# EAGLE design 328p_ ver1 (EAGLE 7.1.0)
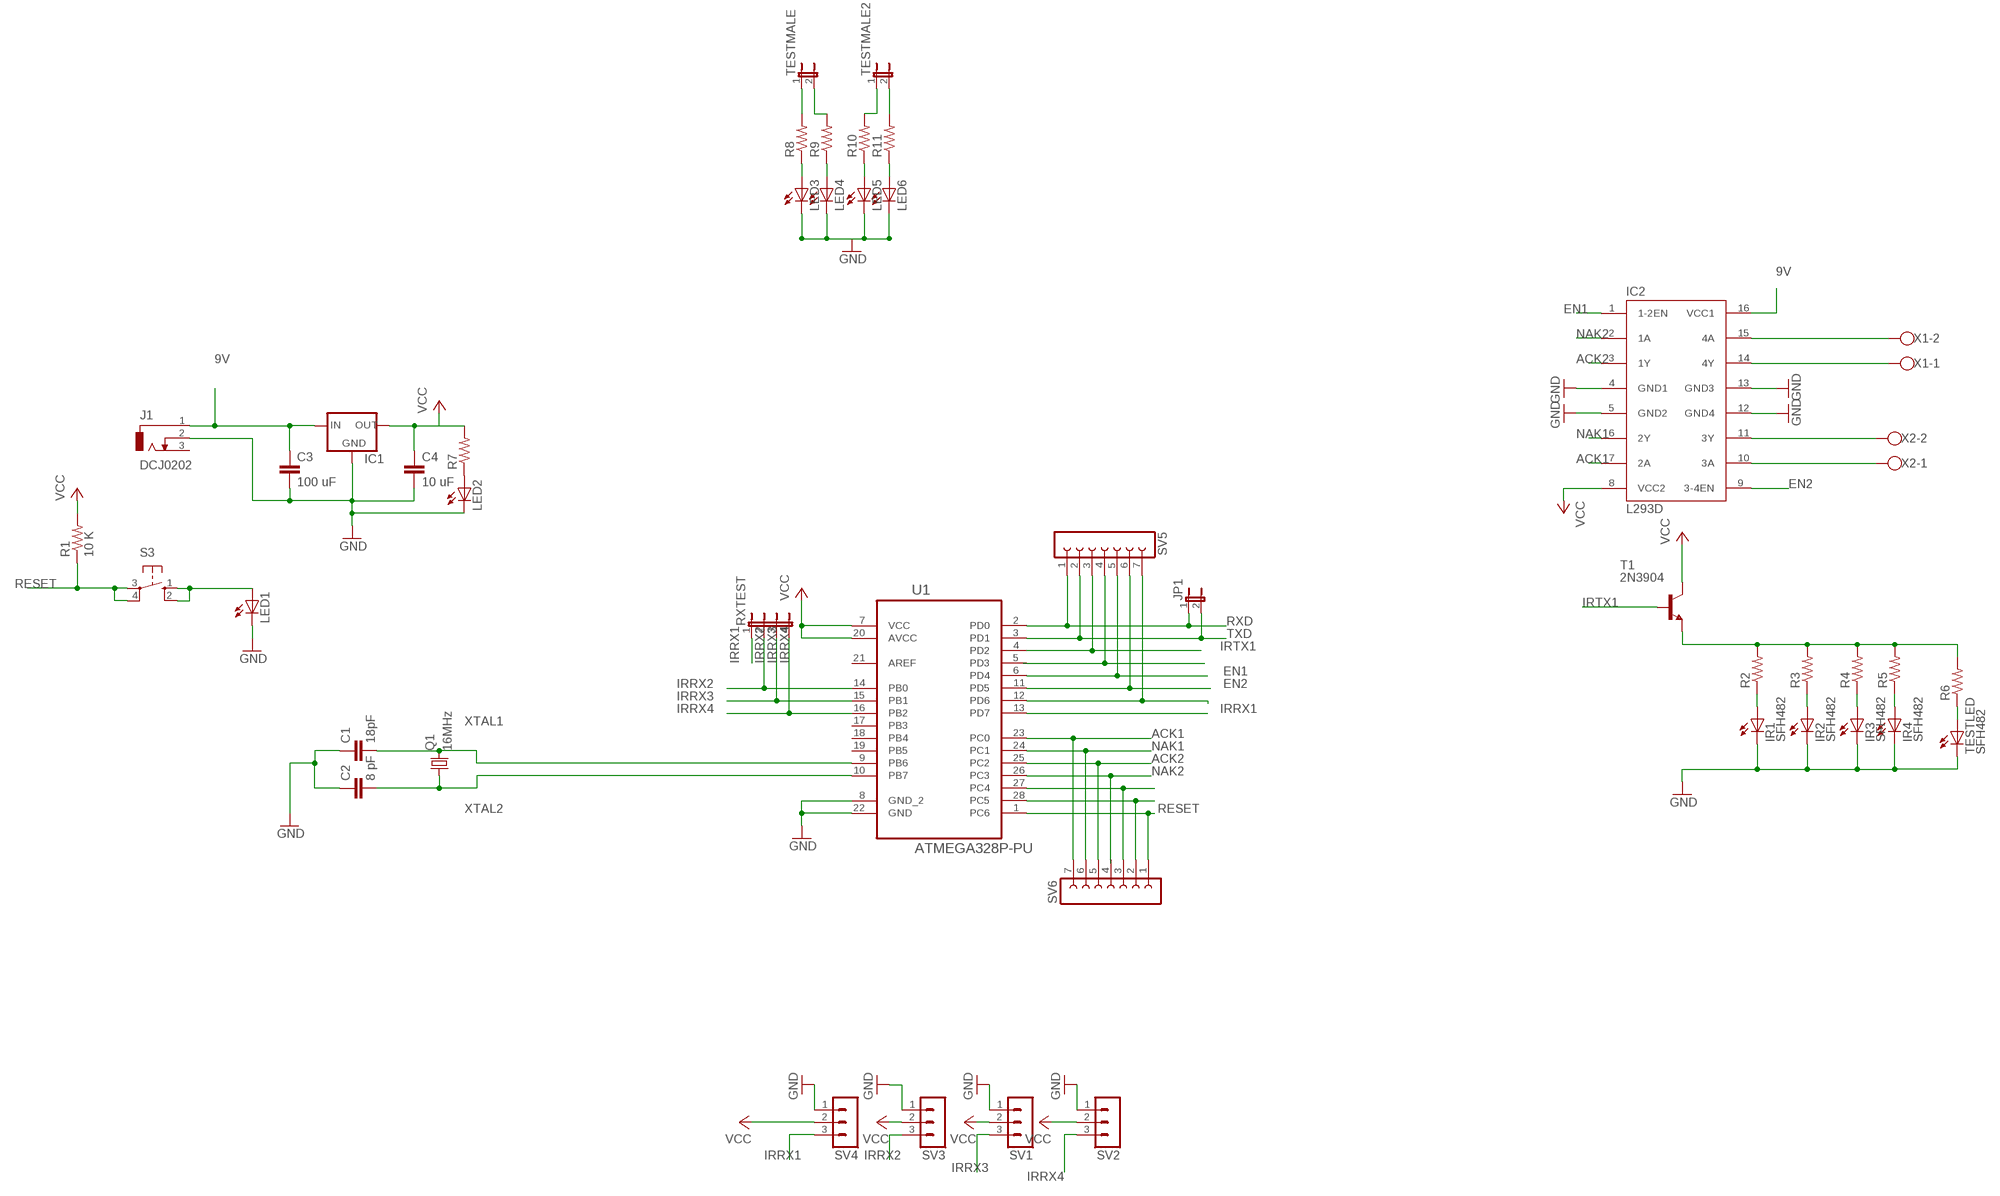
[diagram p0: schematic, sheet 1]

## Parts
C1  18pF  C2,5-3  [C2.5-3]
C2  8 pF  C2,5-3  [C2.5-3]
C3  100 uF  C2,5-3  [C2.5-3]
C4  10 uF  C2,5-3  [C2.5-3]
IC1  78XXS  [78XXS]
IC2  L293D  [DIL16]
IR1  SFH482  [SFH482]
IR2  SFH482  [SFH482]
IR3  SFH482  [SFH482]
IR4  SFH482  [SFH482]
J1  DCJ0202  [DCJ0202]
JP1  JP1E  [JP1]
LED1  LED3MM  [LED3MM]
LED2  LED3MM  [LED3MM]
LED3  LED3MM  [LED3MM]
LED4  LED3MM  [LED3MM]
LED5  LED3MM  [LED3MM]
LED6  LED3MM  [LED3MM]
Q1  16MHz  CRYSTALHC49S  [HC49/S]
R1  10 K  R-US_0207/12  [0207/12]
R2  R-US_0204/7  [0204/7]
R3  R-US_0204/7  [0204/7]
R4  R-US_0204/7  [0204/7]
R5  R-US_0204/7  [0204/7]
R6  R-US_0204/7  [0204/7]
R7  R-US_0204/7  [0204/7]
R8  R-US_0204/7  [0204/7]
R9  R-US_0204/7  [0204/7]
R10  R-US_0204/7  [0204/7]
R11  R-US_0204/7  [0204/7]
RXTEST  JP4E  [JP4]
S3  10-XX  [B3F-10XX]
SV1  MA03-1  [MA03-1]
SV2  MA03-1  [MA03-1]
SV3  MA03-1  [MA03-1]
SV4  MA03-1  [MA03-1]
SV5  FE07-1  [FE07]
SV6  FE07-1  [FE07]
T1  2N3904  [TO92]
TESTLED  SFH482  [SFH482]
TESTMALE  JP1E  [JP1]
TESTMALE2  JP1E  [JP1]
U1  ATMEGA328P-PU  [DIP254P762X457-28]
X1  W237-102  [W237-102]
X2  W237-102  [W237-102]

## Nets
9V: C3.1 IC1.IN IC2.16(VCC1) J1.1
ACK1: IC2.7(2A) SV6.7 U1.23(PC0)
ACK2: IC2.3(1Y) SV6.5 U1.25(PC2)
EN1: IC2.1(1-2EN) SV5.5 U1.6(PD4)
EN2: IC2.9(3-4EN) SV5.6 U1.11(PD5)
GND: C1.1 C2.1 C3.2 C4.2 IC1.GND IC2.4(GND1) IC2.5(GND2) IC2.12(GND4) IC2.13(GND3) IR1.K(C) IR2.K(C) IR3.K(C) IR4.K(C) J1.2 LED1.K(C) LED2.K(C) LED3.K(C) LED4.K(C) LED5.K(C) LED6.K(C) SV1.1 SV2.1 SV3.1 SV4.1 TESTLED.K(C) U1.8(GND_2) U1.22(GND)
IRRX1: RXTEST.1 SV4.3 U1.13(PD7)
IRRX2: RXTEST.2 SV3.3 U1.14(PB0)
IRRX3: RXTEST.3 SV1.3 U1.15(PB1)
IRRX4: RXTEST.4 SV2.3 U1.16(PB2)
IRTX1: SV5.3 T1.2(B) U1.4(PD2)
N$1: IC2.15(4A) X1.2
N$2: IR1.A R2.1
N$3: IR2.A R3.1
N$4: IR3.A R4.1
N$5: IR4.A R5.1
N$6: R2.2 R3.2 R4.2 R5.2 R6.2 T1.3(E)
N$7: IC2.14(4Y) X1.1
N$8: IC2.11(3Y) X2.2
N$9: IC2.10(3A) X2.1
N$10: R6.1 TESTLED.A
N$11: LED2.A R7.1
N$12: R8.2 TESTMALE.1
N$13: LED3.A R8.1
N$14: LED1.A S3.1(S) S3.2(S1)
N$15: R9.2 TESTMALE.2
N$16: LED4.A R9.1
N$17: R10.2 TESTMALE2.1
N$18: R11.2 TESTMALE2.2
N$19: LED6.A R11.1
N$20: LED5.A R10.1
N$23: SV5.4
N$25: SV5.7 U1.12(PD6)
N$27: SV6.3 U1.27(PC4)
N$28: SV6.2 U1.28(PC5)
NAK1: IC2.6(2Y) SV6.6 U1.24(PC1)
NAK2: IC2.2(1A) U1.26(PC3)
RESET: R1.1 S3.3(P) S3.4(P1) SV6.1 U1.1(PC6)
RXD: JP1.1 SV5.1 U1.2(PD0)
TXD: JP1.2 SV5.2 U1.3(PD1)
VCC: C4.1 IC1.OUT IC2.8(VCC2) R1.2 R7.2 SV1.2 SV2.2 SV3.2 SV4.2 T1.1(C) U1.7(VCC) U1.20(AVCC)
XTAL1: C1.2 Q1.2 U1.9(PB6)
XTAL2: C2.2 Q1.1 U1.10(PB7)
Unconnected: J1.3 SV6.4 U1.5(PD3) U1.17(PB3) U1.18(PB4) U1.19(PB5) U1.21(AREF)

## Library data of the parts
C1-C4 = capacitor-wima:C: CAPACITOR naming: grid - package width
IC1 = v-reg:78XXS: VOLTAGE REGULATOR
IC2 = st-microelectronics:L293D: PUSH-PULL 4 CHANNEL DRIVER; MPN: L293D; OC_FARNELL: 9589619; OC_NEWARK: 56P8249
IR1-IR4 TESTLED = led:SFH482: IR LED infrared emitting diode, Infineon
J1 = con-jack:DCJ0202: DC POWER JACK Source: DCJ0202.pdf; OC_FARNELL: unknown; OC_NEWARK: unknown
JP1 TESTMALE TESTMALE2 = jumper:JP1E: JUMPER
LED1-LED6 = led:LED: LED OSRAM: - CHIPLED LG R971, LG N971, LY N971, LG Q971, LY Q971, LO R971, LY R971 LH N974, LH R974 LS Q976, LO Q976, LY Q976 LO Q996 - Hyper CHIPLED LW Q18S LB Q993, LB Q99A, LB R99A - SideLED LS A670, LO A670, LY A670, LG A670, LP A670 LB A673, LV A673, LT A673, LW A673 LH A674 LY A675 LS A676, LA A676, LO A676, LY A676, LW A676 LS A679, LY A679, LG A679 - Hyper Micro SIDELED® LS Y876, LA Y876, LO Y876, LY Y876 LT Y87S - SmartLED LW L88C, LW L88S LB L89C, LB L89S, LG L890 LS L89K, LO L89K, LY L89K LS L896, LA L896, LO L896, LY L896 - TOPLED LS T670, LO T670, LY T670, LG T670, LP T670 LSG T670, LSP T670, LSY T670, LOP T670, LYG T670 LG T671, LOG T671, LSG T671 LB T673, LV T673, LT T673, LW T673 LH T674 LS T676, LA T676, LO T676, LY T676, LB T676, LH T676, LSB T676, LW T676 LB T67C, LV T67C, LT T67C, LS T67K, LO T67K, LY T67K, LW E67C LS E67B, LA E67B, LO E67B, LY E67B, LB E67C, LV E67C, LT E67C LW T67C LS T679, LY T679, LG T679 LS T770, LO T770, LY T770, LG T770, LP T770 LB T773, LV T773, LT T773, LW T773 LH T774 LS E675, LA E675, LY E675, LS T675 LS T776, LA T776, LO T776, LY T776, LB T776 LHGB T686 LT T68C, LB T68C - Hyper Mini TOPLED® LB M676 - Mini TOPLED Santana® LG M470 LS M47K, LO M47K, LY M47K Source: http://www.osram.convergy.de LUXEON: - LUMILED® LXK2-PW12-R00, LXK2-PW12-S00, LXK2-PW14-U00, LXK2-PW14-V00 LXK2-PM12-R00, LXK2-PM12-S00, LXK2-PM14-U00 LXK2-PE12-Q00, LXK2-PE12-R00, LXK2-PE12-S00, LXK2-PE14-T00, LXK2-PE14-U00 LXK2-PB12-K00, LXK2-PB12-L00, LXK2-PB12-M00, LXK2-PB14-N00, LXK2-PB14-P00, LXK2-PB14-Q00 LXK2-PR12-L00, LXK2-PR12-M00, LXK2-PR14-Q00, LXK2-PR14-R00 LXK2-PD12-Q00, LXK2-PD12-R00, LXK2-PD12-S00 LXK2-PH12-R00, LXK2-PH12-S00 LXK2-PL12-P00, LXK2-PL12-Q00, LXK2-PL12-R00 Source: www.luxeon.com KINGBRIGHT: KA-3528ASYC Source: www.kingbright.com
Q1 = crystal:CRYSTAL: CRYSTAL; OC_FARNELL: 1667008; OC_NEWARK: unknown
R1-R11 = resistor:R-US_: RESISTOR, American symbol
RXTEST = jumper:JP4E: JUMPER
S3 = switch-omron:10-XX: OMRON SWITCH; MPN: B3F-1000; OC_FARNELL: 176432; OC_NEWARK: 36M3542
SV1-SV4 = con-lstb:MA03-1: PIN HEADER; OC_FARNELL: unknown; OC_NEWARK: unknown
SV5 SV6 = con-lsta:FE07-1: FEMALE HEADER; OC_FARNELL: unknown; OC_NEWARK: unknown
T1 = transistor:2N3904: NPN TRANSISTOR
U1 = Atmel_By_element14_Batch_1-00:ATMEGA328P-PU: 8-bit Microcontroller with In-System Programmable Flash; MPN: ATMEGA328P-PU; OC_FARNELL: 1715487; OC_NEWARK: 15R0268; PACKAGE: PDIP-28; SUPPLIER: Atmel
X1 X2 = con-wago-500:W237-102: WAGO SCREW CLAMP; MPN: 237-102; OC_FARNELL: unknown; OC_NEWARK: 70K9898

## Board
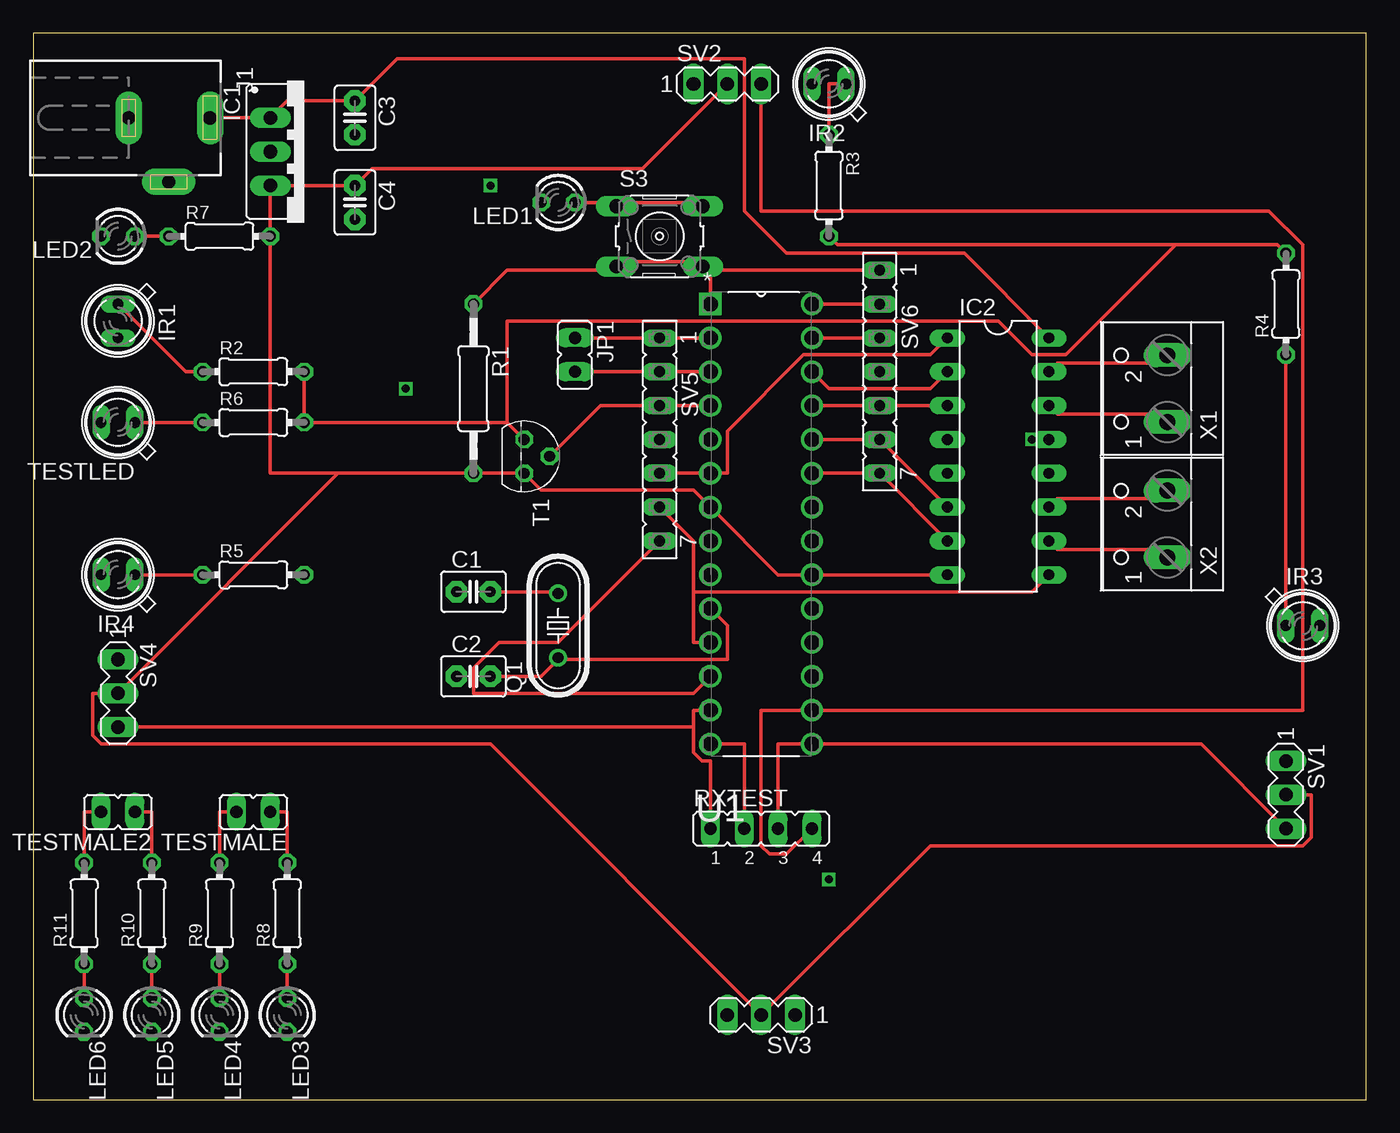
[diagram p1: board, top side]
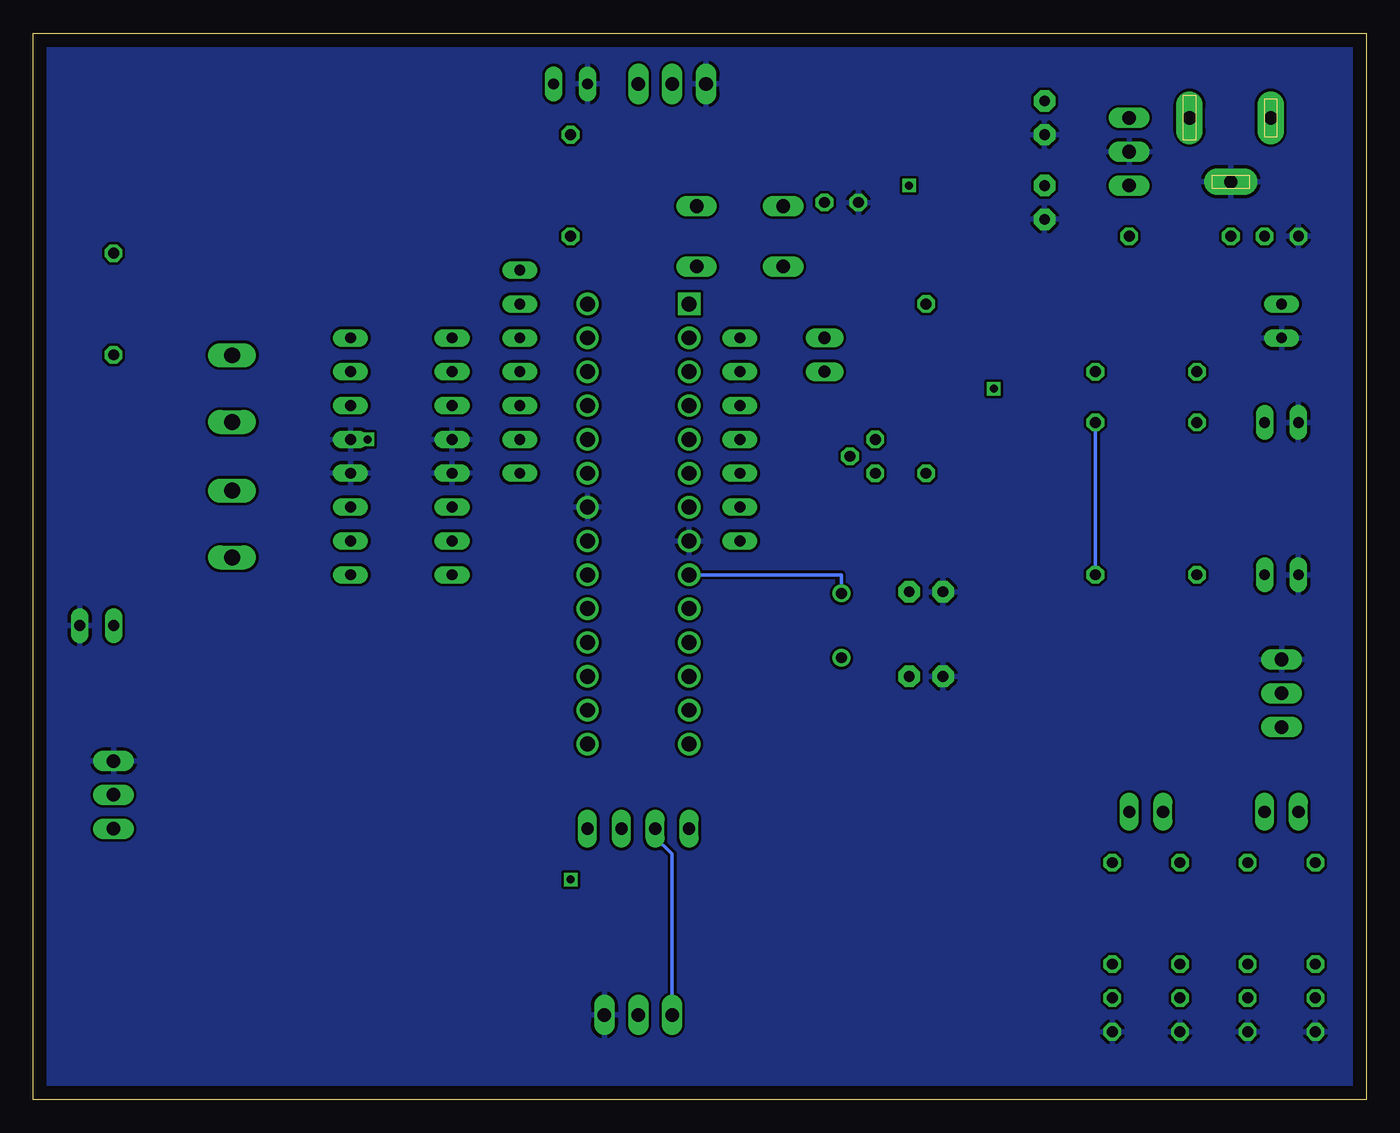
[diagram p2: board, bottom side, seen from below]

Size 100 x 80 mm. Coordinates in mm from the lower left corner, seen from the top.
Outline: 0,0 100,0 100,80 0,80 0,0
Copper layers (1*16): Top 0.035mm / dielectric 1.5mm / Bottom 0.035mm
Design rules "default": minimum track width 10mil, minimum drill 24mil, track to track 8mil, track to pad 8mil, pad to pad 8mil, via to via 8mil, smd to smd 8mil, copper to edge 40mil, drill to drill 8mil, minimum pad ring 10mil, minimum via ring 8mil, stop-mask expansion 4mil, vias tented up to drill 0mil, thermal gap 10mil

### Footprints (pad centres in the part's own frame; a part is rotated, then mirrored left to right if it is on the bottom)
C2.5-3 = drill 0.813 pad 1.6 octagon: 1 -1.27,0; 2 1.27,0
78XXS = drill 1.016 long: GND 0,-2.54; IN -2.54,-2.54; OUT 2.54,-2.54
DIL16 = drill 0.813 long: 1 -8.89,-3.81; 2 -6.35,-3.81; 3 -3.81,-3.81; 4 -1.27,-3.81; 5 1.27,-3.81; 6 3.81,-3.81; 7 6.35,-3.81; 8 8.89,-3.81; 9 8.89,3.81; 10 6.35,3.81; 11 3.81,3.81; 12 1.27,3.81; 13 -1.27,3.81; 14 -3.81,3.81; 15 -6.35,3.81; 16 -8.89,3.81
SFH482 = drill 0.813 long: A -1.27,0; K 1.27,0
DCJ0202 = drill 1 pad 2 long: 1 0,3.1; 2 4.8,0; 3 0,-3
JP1 = drill 0.914 long: 1 0,-1.27; 2 0,1.27
LED3MM = drill 0.813 octagon: A -1.27,0; K 1.27,0
HC49/S = drill 0.813: 1 -2.413,0; 2 2.413,0
0207/12 = drill 0.813 octagon: 1 -6.35,0; 2 6.35,0
0204/7 = drill 0.813 octagon: 1 -3.81,0; 2 3.81,0
JP4 = drill 0.914 long: 1 -3.81,0; 2 -1.27,0; 3 1.27,0; 4 3.81,0
B3F-10XX = drill 1.016 long: 1 -3.251,2.261; 2 3.251,2.261; 3 -3.251,-2.261; 4 3.251,-2.261
MA03-1 = drill 1.016 long: 1 -2.54,0; 2 0,0; 3 2.54,0
FE07 = drill 0.813 long: 1 -7.62,0; 2 -5.08,0; 3 -2.54,0; 4 0,0; 5 2.54,0; 6 5.08,0; 7 7.62,0
TO92 = drill 0.813 octagon: 1 1.27,0; 2 0,1.905; 3 -1.27,0
DIP254P762X457-28 = drill 1.118 square: 1 -7.62,33.02 | drill 1.118: 2 -7.62,30.48; 3 -7.62,27.94; 4 -7.62,25.4; 5 -7.62,22.86; 6 -7.62,20.32; 7 -7.62,17.78; 8 -7.62,15.24; 9 -7.62,12.7; 10 -7.62,10.16; 11 -7.62,7.62; 12 -7.62,5.08; 13 -7.62,2.54; 14 -7.62,0; 15 0,0; 16 0,2.54; 17 0,5.08; 18 0,7.62; 19 0,10.16; 20 0,12.7; 21 0,15.24; 22 0,17.78; 23 0,20.32; 24 0,22.86; 25 0,25.4; 26 0,27.94; 27 0,30.48; 28 0,33.02
W237-102 = drill 1.194 long: 1 -2.5,-1.27; 2 2.5,-1.27

### Placement (x,y rotation side)
C1  33.02,38.1 0 top
C2  33.02,31.75 0 top
C3  24.13,73.66 270 top
C4  24.13,67.31 270 top
IC1  20.32,71.12 270 top
IC2  72.39,48.26 270 top
IR1  6.35,58.42 270 top
IR2  59.69,76.2 180 top
IR3  95.25,35.56 0 top
IR4  6.35,39.37 180 top
J1  10.16,73.66 270 top
JP1  40.64,55.88 180 top
LED1  39.37,67.31 180 top
LED2  6.35,64.77 180 top
LED3  19.05,6.35 270 top
LED4  13.97,6.35 270 top
LED5  8.89,6.35 270 top
LED6  3.81,6.35 270 top
Q1  39.37,35.56 90 top
R1  33.02,53.34 270 top
R2  16.51,54.61 0 top
R3  59.69,68.58 270 top
R4  93.98,59.69 90 top
R5  16.51,39.37 0 top
R6  16.51,50.8 0 top
R7  13.97,64.77 0 top
R8  19.05,13.97 90 top
R9  13.97,13.97 90 top
R10  8.89,13.97 90 top
R11  3.81,13.97 90 top
RXTEST  54.61,20.32 0 top
S3  46.99,64.77 0 top
SV1  93.98,22.86 270 top
SV2  52.07,76.2 0 top
SV3  54.61,6.35 180 top
SV4  6.35,30.48 270 top
SV5  46.99,49.53 270 top
SV6  63.5,54.61 270 top
T1  36.83,48.26 270 top
TESTLED  6.35,50.8 180 top
TESTMALE  16.51,21.59 90 top
TESTMALE2  6.35,21.59 90 top
U1  58.42,26.67 0 top
X1  83.82,53.34 90 top
X2  83.82,43.18 90 top

### Tracks (layer width: path | path; a pad name or v marks a point on that pad's centre or on a via)
9V
  Top 0.254: J1.1 IC1.IN 19.05,74.93 C3.1 27.3,78.11 53.34,78.11 53.34,66.67 56.52,63.5 69.85,63.5 IC2.16
ACK1
  Top 0.254: U1.23 SV6.7 IC2.7
ACK2
  Top 0.254: U1.25 SV6.5 IC2.3
EN1
  Top 0.254: SV5.5 U1.6 52.07,46.99 52.07,50.16 57.78,55.88 67.31,55.88 IC2.1
EN2
  Top 0.254: SV5.6 49.53,41.91 49.53,38.1 | 49.53,38.1 49.53,34.29 U1.11 | IC2.9 74.93,38.1 49.53,38.1
GND
  pour Bottom: 0,0 0,80.01 100.33,80.01 100.33,0
IRRX1
  Top 0.254: RXTEST.1 50.8,25.4 50.16,25.4 49.53,26.04 49.53,27.94 | 49.53,27.94 49.53,29.21 U1.13 | 49.53,27.94 SV4.3
IRRX2
  Top 0.254: RXTEST.2 53.34,26.67 U1.14
  Bottom 0.254: SV3.3 52.07,18.41 53.34,19.68 RXTEST.2
IRRX3
  Top 0.254: RXTEST.3 55.88,26.67 U1.15 87.63,26.67 SV1.3
IRRX4
  Top 0.254: RXTEST.4 56.52,18.41 55.24,18.41 54.61,19.05 54.61,29.21 U1.16 95.25,29.21 95.25,64.14 92.71,66.67 54.61,66.67 SV2.3
IRTX1
  Top 0.254: T1.2 42.55,52.07 SV5.3 U1.4
N$1
  Top 0.254: IC2.15 76.83,55.24 85.09,55.24 X1.2
N$2
  Top 0.254: IR1.A 11.43,54.61 R2.1
N$3
  Top 0.254: R3.1 59.69,76.2 IR2.A
N$4
  Top 0.254: R4.1 IR3.A
N$5
  Top 0.254: R5.1 IR4.A
N$6
  Top 0.254: R2.2 R6.2 35.56,50.8 | 35.56,50.8 T1.3 | R3.2 60.33,64.14 85.72,64.14 | 85.72,64.14 93.34,64.14 R4.2 | 35.56,50.8 35.56,58.42 72.39,58.42 74.93,55.88 77.47,55.88 85.72,64.14
  Bottom 0.254: R6.2 R5.2
N$7
  Top 0.254: IC2.14 76.83,51.44 85.09,51.44 X1.1
N$8
  Top 0.254: IC2.11 76.83,45.09 85.09,45.09 X2.2
N$9
  Top 0.254: IC2.10 76.83,41.27 85.09,41.27 X2.1
N$10
  Top 0.254: R6.1 TESTLED.A
N$11
  Top 0.254: R7.1 LED2.A
N$12
  Top 0.254: R8.2 19.05,21.59 TESTMALE.1
N$13
  Top 0.254: R8.1 LED3.A
N$14
  Top 0.254: LED1.A 43.18,67.31 S3.1 43.81,67.31 50.16,67.31 S3.2
N$15
  Top 0.254: R9.2 13.97,21.59 TESTMALE.2
N$16
  Top 0.254: R9.1 LED4.A
N$17
  Top 0.254: R10.2 8.89,21.59 TESTMALE2.1
N$18
  Top 0.254: R11.2 3.81,21.59 TESTMALE2.2
N$19
  Top 0.254: R11.1 LED6.A
N$20
  Top 0.254: R10.1 LED5.A
N$21  (via drill 0.6)
  other vias: 27.94,53.34
N$22  (via drill 0.6)
  other vias: 59.69,16.51
N$24  (via drill 0.6)
  other vias: 34.29,68.58
N$25
  Top 0.254: SV5.7 39.37,34.29 34.92,34.29 33.02,32.38 33.02,30.48 49.53,30.48 U1.12
N$26  (via drill 0.6)
  other vias: 74.93,49.53
N$27
  Top 0.254: U1.27 SV6.3
N$28
  Top 0.254: U1.28 SV6.2
NAK1
  Top 0.254: U1.24 SV6.6 IC2.6
NAK2
  Top 0.254: IC2.2 67.31,53.34 59.69,53.34 U1.26
RESET
  Top 0.254: R1.1 35.56,62.23 43.18,62.23 S3.3 43.81,62.87 50.16,62.87 S3.4 50.8,62.23 | 50.8,62.23 SV6.1 | 50.8,62.23 U1.1
RXD
  Top 0.254: U1.2 SV5.1 JP1.1
TXD
  Top 0.254: U1.3 SV5.2 JP1.2
VCC
  Top 0.254: SV1.2 95.89,22.86 95.89,19.68 95.25,19.05 67.31,19.05 SV3.2 34.29,26.67 5.08,26.67 4.45,27.3 4.45,30.48 SV4.2 22.86,46.99 | SV2.2 45.72,69.85 25.4,69.85 C4.1 IC1.OUT R7.2 17.78,46.99 22.86,46.99 | IC2.8 U1.20 55.88,39.37 U1.7 49.53,45.72 38.1,45.72 T1.1 R1.2 22.86,46.99
XTAL1
  Top 0.254: C1.2 39.37,38.1 Q1.2
  Bottom 0.254: U1.9 39.37,39.37 Q1.2
XTAL2
  Top 0.254: 39.37,33.02 38.1,31.75 C2.2 | U1.10 52.07,35.56 52.07,33.02 39.37,33.02 | 39.37,33.02 Q1.1